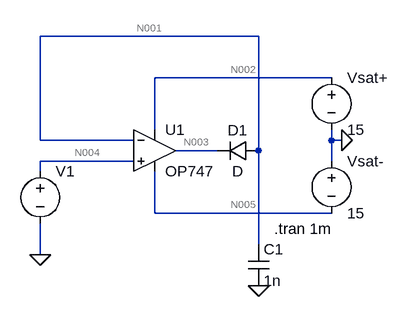
[diagram p0: schematic PEAK_VALUE_DETECTOR_NEG.asc]
PEAK_VALUE_DETECTOR_NEG.asc, the LTspice schematic file:
Version 4
SHEET 1 1584 680
WIRE 544 -16 208 -16
WIRE 656 48 384 48
WIRE 384 128 384 48
WIRE 208 144 208 -16
WIRE 352 144 208 144
WIRE 656 144 656 128
WIRE 672 144 656 144
WIRE 480 160 416 160
WIRE 544 160 544 -16
WIRE 352 176 208 176
WIRE 656 176 656 144
WIRE 208 192 208 176
WIRE 384 256 384 192
WIRE 656 256 384 256
WIRE 544 304 544 160
WIRE 208 320 208 272
FLAG 672 144 0
FLAG 208 320 0
FLAG 544 368 0
SYMBOL OpAmps\\OP747 384 96 R0
SYMATTR InstName U1
SYMBOL voltage 656 32 R0
WINDOW 123 0 0 Left 0
WINDOW 39 0 0 Left 0
SYMATTR InstName Vsat+
SYMATTR Value 15
SYMBOL voltage 656 160 R0
WINDOW 123 0 0 Left 0
WINDOW 39 0 0 Left 0
SYMATTR InstName Vsat-
SYMATTR Value 15
SYMBOL cap 528 304 R0
SYMATTR InstName C1
SYMATTR Value 1n
SYMBOL voltage 208 176 R0
WINDOW 3 24 96 Invisible 2
WINDOW 123 0 0 Left 0
WINDOW 39 0 0 Left 0
SYMATTR Value SINE(0 1 1K)
SYMATTR InstName V1
SYMBOL diode 544 144 R90
WINDOW 0 0 32 VBottom 2
WINDOW 3 32 32 VTop 2
SYMATTR InstName D1
TEXT 568 280 Left 2 !.tran 1m

The netlist it stands for:
* PEAK_VALUE_DETECTOR_NEG.asc
XU1 N004 N001 N002 N005 N003 OP747  ; pins In+ In- V+ V- OUT
Vsat+ N002 0 15
Vsat- 0 N005 15
C1 N001 0 1n
V1 N004 0 SINE(0 1 1K)
D1 N001 N003 D
.model D D
.lib standard.dio
.tran 1m
.backanno
.end

* Results of the author's LTspice run, read from the files saved beside the schematic
* Operating Point, zero values left out:
*   V(n001) = 80.01 µV
*   V(n005) = -15 V
*   V(n002) = 15 V
*   V(n003) = -354.1 mV
*   I(D1) = 8.856 nA
*   I(V1) = 10.86 nA
*   I(Vsat-) = -304.5 µA
*   I(Vsat+) = -304.5 µA
*   Ix(u1:1) = -10.86 nA
*   Ix(u1:2) = -8.856 nA
*   Ix(u1:99) = 304.5 µA
*   Ix(u1:50) = -304.5 µA
*   Ix(u1:45) = 8.856 nA
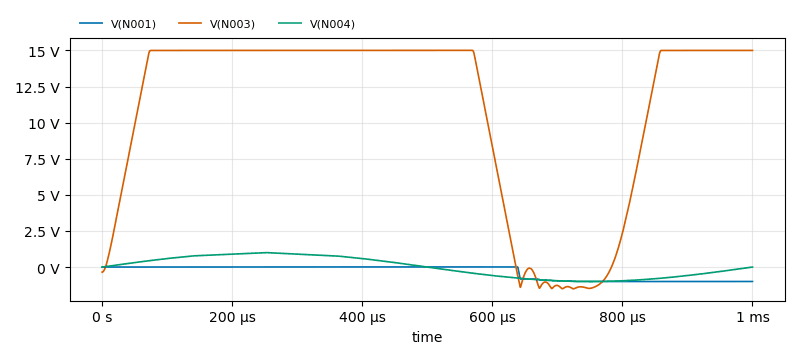
[diagram p1: Transient Analysis of PEAK_VALUE_DETECTOR_NEG.asc, plotted from the saved traces]
* Transient Analysis, 1 run:
*   V(N001): min -1.003 V, max 9.351 mV, average -347.4 mV, rms 586.3 mV, last -999 mV
*   V(N003): min -1.506 V, max 15 V, average 10.94 V, rms 12.64 V, last 15 V
*   V(N004): min -1 V, max 998.4 mV, average -8.744 mV, rms 698.3 mV, last 0 V